# EAGLE schematic v2 (EAGLE 9.2.2)
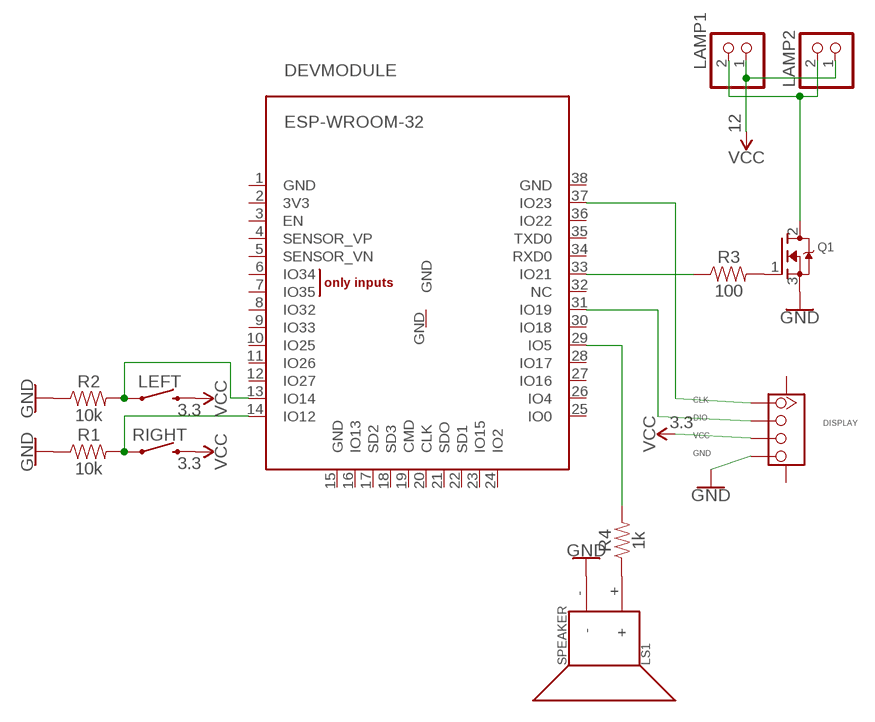
[diagram p0: schematic, sheet 1]

## Parts
DEVMODULE  ESP-WROOM-32  [ESP-WROOM-32]
DISPLAY  TWIG-4P-2.0-SMD-FEMALE-REINFORCE'90D'  [4P-SMD-2.0-90D]
LAMP1  JST_2PIN-THM  [JST-PH-2-THM]
LAMP2  JST_2PIN-THM  [JST-PH-2-THM]
LEFT  MOMENTARY-SWITCH-SPST-PTH-6.0MM  [TACTILE_SWITCH_PTH_6.0MM]
LS1  SPEAKER  [PCB_MOUNT_SPEAKER]
Q1  MOSFET-NGDS_TO220V  [TO220V]
R1  10k  10KOHM-0603-1/10W-1%  [0603]
R2  10k  10KOHM-0603-1/10W-1%  [0603]
R3  100  100OHM-0603-1/4W-5%  [0603]
R4  1k  1KOHM-HORIZ_KIT-1/4W-1%  [AXIAL-0.3-KIT]
RIGHT  MOMENTARY-SWITCH-SPST-PTH-6.0MM  [TACTILE_SWITCH_PTH_6.0MM]

## Nets
CLK: DEVMODULE.37(IO23) DISPLAY.1
DIO: DEVMODULE.31(IO19) DISPLAY.2
GND: DISPLAY.4 LS1.- Q1.3(S) R1.1 R2.1
N$1: DEVMODULE.14(IO12) R1.2 RIGHT.1
N$2: DEVMODULE.13(IO14) LEFT.1 R2.2
N$3: DEVMODULE.33(IO21) R3.1
N$4: Q1.1(G) R3.2
N$5: DEVMODULE.29(IO5) R4.P$2
N$6: LAMP1.2 LAMP2.2 Q1.2(D)
N$7: LS1.+ R4.P$1
VCC: DISPLAY.3 LAMP1.1 LAMP2.1 LEFT.3 RIGHT.3
Unconnected: DEVMODULE.1(GND) DEVMODULE.2(3V3) DEVMODULE.3(EN) DEVMODULE.4(SENSOR_VP) DEVMODULE.5(SENSOR_VN) DEVMODULE.6(IO34) DEVMODULE.7(IO35) DEVMODULE.8(IO32) DEVMODULE.9(IO33) DEVMODULE.10(IO25) DEVMODULE.11(IO26) DEVMODULE.12(IO27) DEVMODULE.15(GND) DEVMODULE.16(IO13) DEVMODULE.17(SD2) DEVMODULE.18(SD3) DEVMODULE.19(CMD) DEVMODULE.20(CLK) DEVMODULE.21(SDO) DEVMODULE.22(SD1) DEVMODULE.23(IO15) DEVMODULE.24(IO2) DEVMODULE.25(IO0) DEVMODULE.26(IO4) DEVMODULE.27(IO16) DEVMODULE.28(IO17) DEVMODULE.30(IO18) DEVMODULE.32(NC) DEVMODULE.34(RXD0) DEVMODULE.35(TXD0) DEVMODULE.36(IO22) DEVMODULE.38(GND) DEVMODULE.GND DISPLAY.SS1 DISPLAY.SS2

## Library data of the parts
DEVMODULE = esp32:ESP-WROOM-32
DISPLAY = Connector:TWIG-4P-2.0-SMD-FEMALE-REINFORCE
LAMP1 LAMP2 = adafruit:JST_2PIN: JST 2-Pin Connectors of various flavors SMT-RA (S2B-PH-SM4) 4UConnector #17311 SMT (B2B-PH-SM4) THM-RA (S2B-PH) THM (B2B-PH)
LEFT RIGHT = SparkFun-Switches:MOMENTARY-SWITCH-SPST: Momentary Switch (Pushbutton) - SPST Normally-open (NO) SPST momentary switches (buttons, pushbuttons). Variants PTH-12MM - 12mm square, through-hole Momentary Pushbutton Switch - 12mm Square <https://www.sparkfun.com/products/9190> (COM-09190) PTH-6.0MM, PTH-6.0MM-KIT - 6.0mm square, through-hole Mini Pushbutton Switch <https://www.sparkfun.com/products/97> (COM-00097) KIT package intended for soldering kit's - only one side of pads' copper is exposed. PTH-RIGHT-ANGLE-KIT - Right-angle, through-hole Right Angle Tactile Button <https://www.sparkfun.com/products/10791> - Used on SparkFun BigTime Watch Kit <https://www.sparkfun.com/products/11734> SMD-12MM - 12mm square, surface-mount Tactile Button - SMD (12mm) <https://www.sparkfun.com/products/12993> (COM-12993) Used on SparkFun PicoBoard <https://www.sparkfun.com/products/11888> SMD-4.5MM - 4.5mm Square Trackball Switch Used on SparkFun Blackberry Trackballer Breakout <https://www.sparkfun.com/products/13169> SMD-4.6MMX2.8MM - 4.60mm x 2.80mm, surface mount Used on SparkFun SAMD21 Mini Breakout <https://www.sparkfun.com/products/13664> SMD-5.2MM, SMD-5.2-REDUNDANT - 5.2mm square, surface-mount Mini Pushbutton Switch - SMD <https://www.sparkfun.com/products/8720> (COM-08720) Used on Arduino Pro Mini <https://www.sparkfun.com/products/11114> REDUNDANT package connects both switch circuits together SMD-6.0X3.5MM - 6.0 x 3.5mm, surface mount Momentary Reset Switch SMD <https://www.sparkfun.com/products/8229> (COM-08229) SMD-6.2MM-TALL - 6.2mm square, surface mount Tactile Button - SMD (6mm) <https://www.sparkfun.com/products/12992> Used on SparkFun Digital Sandbox <https://www.sparkfun.com/products/12651> SMD-RIGHT-ANGLE - Right-angle, surface mount Used on SparkFun Block for Intel® Edison - Arduino <https://www.sparkfun.com/products/13036>; DIRECTION: right; PROD_ID: SWCH-08441; SF_SKU: COM-00097
LS1 = SparkFun-Electromechanical:SPEAKER: Speaker Generic 2-terminal loudspeakers SparkFun Products Speaker - PCB Mount <https://www.sparkfun.com/products/11089> (COM-11089); PROD_ID: COMP-11789; SF_SKU: COM-11089
Q1 = adafruit:MOSFET-N: N-Channel Mosfet 2N7002E - 60V 260mA SOT23 [Digikey: 2N7002ET1GOSTR-ND] - REEL BSH103 - 30V 850mA SOT23 [Digikey: 568-5013-1-ND]
R1 R2 = SparkFun-Resistors:10KOHM: 10kΩ resistor A resistor is a passive two-terminal electrical component that implements electrical resistance as a circuit element. Resistors act to reduce current flow, and, at the same time, act to lower voltage levels within circuits. - Wikipedia; PROD_ID: RES-00824
R3 = SparkFun-Resistors:100OHM: 100Ω resistor A resistor is a passive two-terminal electrical component that implements electrical resistance as a circuit element. Resistors act to reduce current flow, and, at the same time, act to lower voltage levels within circuits. - Wikipedia; PROD_ID: RES-12438
R4 = SparkFun-Resistors:1KOHM: 1kΩ resistor A resistor is a passive two-terminal electrical component that implements electrical resistance as a circuit element. Resistors act to reduce current flow, and, at the same time, act to lower voltage levels within circuits. - Wikipedia; PROD_ID: RES-12182